# EAGLE design SigueLinea-final-SIN-PLANO-GND (EAGLE 7.4.0)
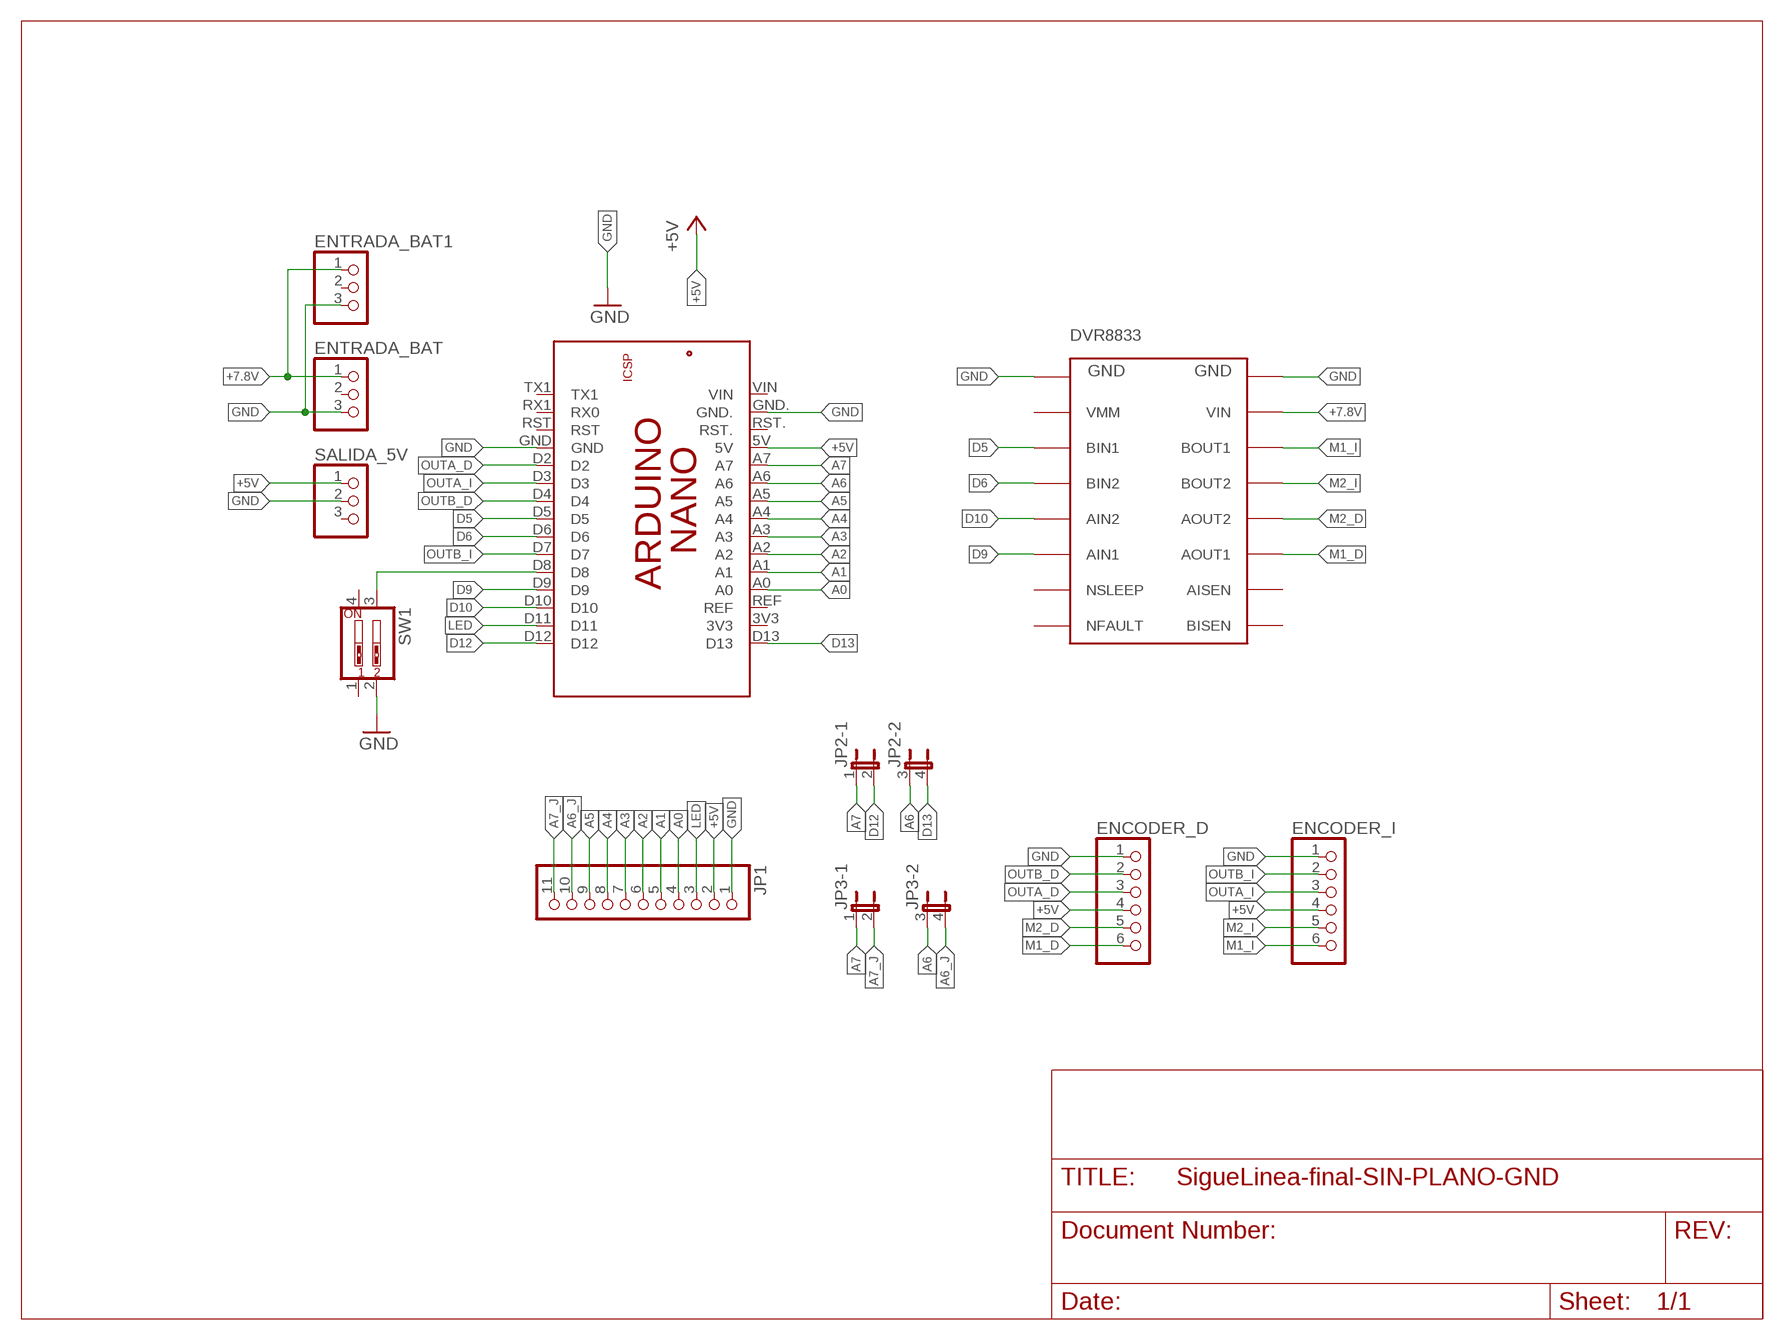
[diagram p0: schematic, sheet 1]

## Parts
DVR8833  DRV8833  [DRV8833]
ENCODER_D  PINHD-1X6  [1X06]
ENCODER_I  PINHD-1X6  [1X06]
ENTRADA_BAT  PINHD-1X3  [1X03]
ENTRADA_BAT1  PINHD-1X3  [1X03]
JP1  PINHD-1X11  [1X11]
JP2  JP2QE  [JP2Q]
JP3  JP2QE  [JP2Q]
PCB1  ARDUINO_NANO  [ARDUINO_NANO]
SALIDA_5V  PINHD-1X3  [1X03]
SW1  SW_DIP-2  [EDG-02]

## Nets
+5V: ENCODER_D.4 ENCODER_I.4 JP1.2 PCB1.5V SALIDA_5V.1
+7.8V: DVR8833.VIN ENTRADA_BAT1.1 ENTRADA_BAT.1
A0: JP1.4 PCB1.A0
A1: JP1.5 PCB1.A1
A2: JP1.6 PCB1.A2
A3: JP1.7 PCB1.A3
A4: JP1.8 PCB1.A4
A5: JP1.9 PCB1.A5
A6: JP2.3 JP3.3 PCB1.A6
A6_J: JP1.10 JP3.4
A7: JP2.1 JP3.1 PCB1.A7
A7_J: JP1.11 JP3.2
D5: DVR8833.BIN1 PCB1.D5
D6: DVR8833.BIN2 PCB1.D6
D9: DVR8833.AIN1 PCB1.D9
D10: DVR8833.AIN2 PCB1.D10
D12: JP2.2 PCB1.D12
D13: JP2.4 PCB1.D13
GND: DVR8833.GND1 DVR8833.GND2 ENCODER_D.1 ENCODER_I.1 ENTRADA_BAT1.3 ENTRADA_BAT.3 JP1.1 PCB1.GND PCB1.GND. SALIDA_5V.2 SW1.2
LED: JP1.3 PCB1.D11
M1_D: DVR8833.AOUT1 ENCODER_D.6
M1_I: DVR8833.BOUT1 ENCODER_I.6
M2_D: DVR8833.AOUT2 ENCODER_D.5
M2_I: DVR8833.BOUT2 ENCODER_I.5
N$1: PCB1.D8 SW1.3
OUTA_D: ENCODER_D.3 PCB1.D2
OUTA_I: ENCODER_I.3 PCB1.D3
OUTB_D: ENCODER_D.2 PCB1.D4
OUTB_I: ENCODER_I.2 PCB1.D7
Unconnected: DVR8833.AISEN DVR8833.BISEN DVR8833.NFAULT DVR8833.NSLEEP DVR8833.VMM ENTRADA_BAT1.2 ENTRADA_BAT.2 PCB1.3V3 PCB1.REF PCB1.RST PCB1.RST. PCB1.RX1(RX0) PCB1.TX1 PCB1.VIN SALIDA_5V.3 SW1.1 SW1.4

## Library data of the parts
DVR8833 = Motor-Driver:DRV8833
ENCODER_D ENCODER_I = pinhead:PINHD-1X6: PIN HEADER
ENTRADA_BAT ENTRADA_BAT1 SALIDA_5V = pinhead:PINHD-1X3: PIN HEADER
JP1 = pinhead:PINHD-1X11: PIN HEADER
JP2 JP3 = jumper:JP2QE: JUMPER
PCB1 = E14_Arduino_revB_modificado:ARDUINO_NANO: Device for representing an Arduino Nano board with a footprint in an EAGLE design. Created by Dave Young for Element14. More EAGLE documentation at: http://www.element14.com/community/community/knode/cadsoft_eagle
SW1 = special:SW_DIP-2: DIP SWITCH

## Board
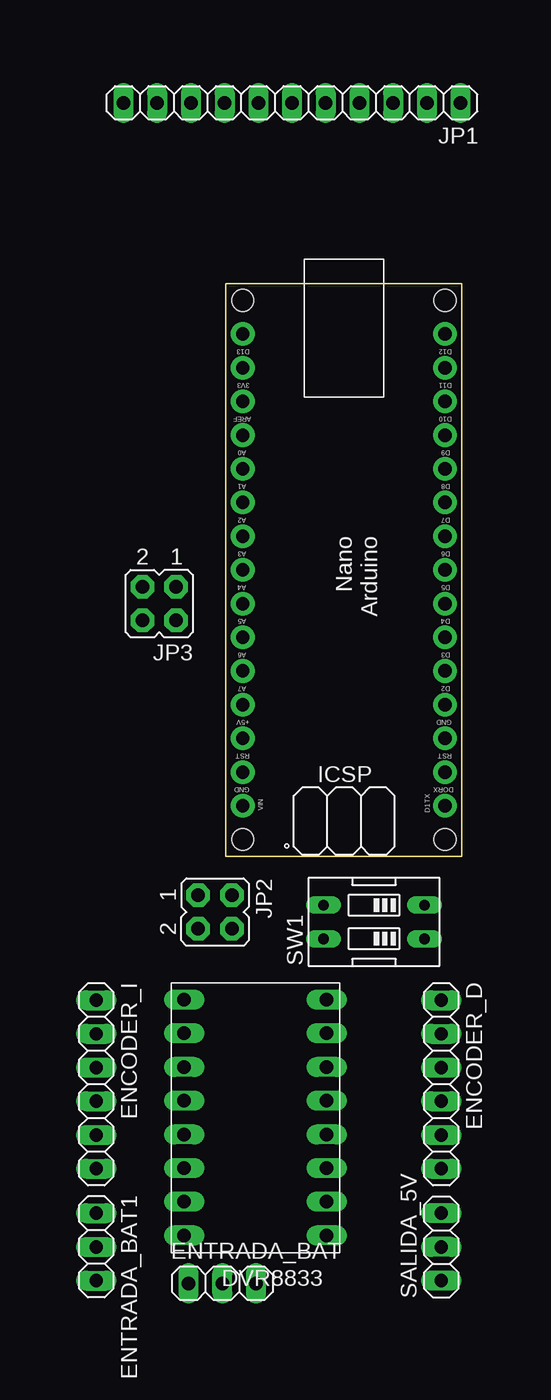
[diagram p1: board, top side]
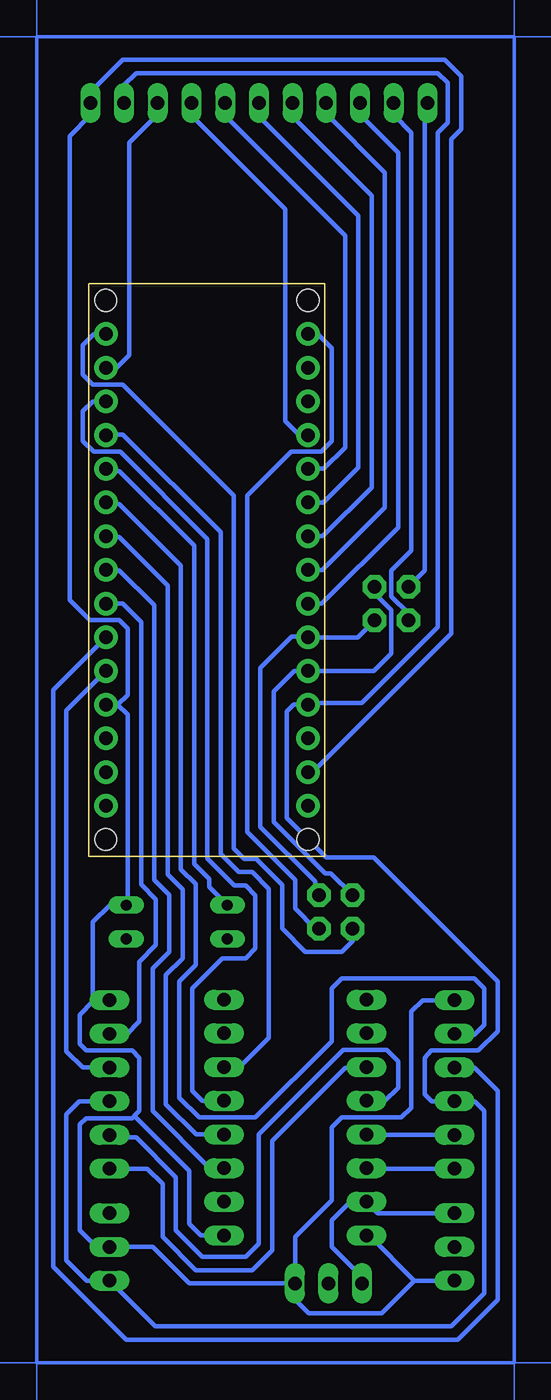
[diagram p2: board, bottom side, seen from below]

Size 17.78 x 43.18 mm. Coordinates in mm from the lower left corner, seen from the top.
Copper layers (1*16): Top 0.035mm / dielectric 1.5mm / Bottom 0.035mm
Design rules "default": minimum track width 10mil, minimum drill 24mil, track to track 8mil, track to pad 8mil, pad to pad 8mil, via to via 8mil, smd to smd 8mil, copper to edge 40mil, drill to drill 8mil, minimum pad ring 10mil, minimum via ring 8mil, stop-mask expansion 4mil, vias tented up to drill 0mil, thermal gap 10mil

### Footprints (pad centres in the part's own frame; a part is rotated, then mirrored left to right if it is on the bottom)
DRV8833 = drill 1.016 long: AIN1 -5.37,-3.83; AIN2 -5.37,-1.29; AISEN 5.37,-6.37; AOUT1 5.37,-3.83; AOUT2 5.37,-1.29; BIN1 -5.37,3.79; BIN2 -5.37,1.25; BISEN 5.37,-8.91; BOUT1 5.37,3.79; BOUT2 5.37,1.25; GND1 -5.37,8.87; GND2 5.37,8.87; NFAULT -5.37,-8.91; NSLEEP -5.37,-6.37; VIN 5.37,6.33; VMM -5.37,6.33
1X06 = drill 1.016 long: 1 -6.35,0; 2 -3.81,0; 3 -1.27,0; 4 1.27,0; 5 3.81,0; 6 6.35,0
1X03 = drill 1.016 long: 1 -2.54,0; 2 0,0; 3 2.54,0
1X11 = drill 1.016 long: 1 -12.7,0; 2 -10.16,0; 3 -7.62,0; 4 -5.08,0; 5 -2.54,0; 6 0,0; 7 2.54,0; 8 5.08,0; 9 7.62,0; 10 10.16,0; 11 12.7,0
JP2Q = drill 1.016 pad 1.778 octagon: 1 -1.27,-1.27; 2 1.27,-1.27; 3 -1.27,1.27; 4 1.27,1.27
ARDUINO_NANO = drill 1.016 pad 1.778: 3V3 6.35,1.27; 5V 31.75,1.27; A0 11.43,1.27; A1 13.97,1.27; A2 16.51,1.27; A3 19.05,1.27; A4 21.59,1.27; A5 24.13,1.27; A6 26.67,1.27; A7 29.21,1.27; D2 29.21,16.51; D3 26.67,16.51; D4 24.13,16.51; D5 21.59,16.51; D6 19.05,16.51; D7 16.51,16.51; D8 13.97,16.51; D9 11.43,16.51; D10 8.89,16.51; D11 6.35,16.51; D12 3.81,16.51; D13 3.81,1.27; GND 31.75,16.51; GND. 36.83,1.27; REF 8.89,1.27; RST 34.29,16.51; RST. 34.29,1.27; RX1 36.83,16.51; TX1 39.37,16.51; VIN 39.37,1.27 | hole 1.651: 1.27,1.27; 1.27,16.51; 41.91,16.51; 41.91,1.27
EDG-02 = drill 0.813 long: 1 -1.27,-3.81; 2 1.27,-3.81; 3 1.27,3.81; 4 -1.27,3.81

### Placement (x,y rotation side)
DVR8833  2.23,-19.72 180 top  (outside the outline)
ENCODER_D  16.23,-17.2 270 top  (outside the outline)
ENCODER_I  -9.77,-17.2 270 top  (outside the outline)
ENTRADA_BAT  -0.27,-32.2 0 top  (outside the outline)
ENTRADA_BAT1  -9.77,-29.45 270 top  (outside the outline)
JP1  4.98,56.8 180 top  (outside the outline)
JP2  -0.82,-4.2 270 top
JP3  -5.02,19.05 180 top  (outside the outline)
PCB1  0,43.18 270 top
SALIDA_5V  16.23,-29.45 90 top  (outside the outline)
SW1  11.16,-4.95 90 top  (outside the outline)

### Tracks (layer width: path | path; a pad name or v marks a point on that pad's centre or on a via)
+5V
  Bottom 0.35: JP1.2 15.14,58.14 14.23,59.05 -8.52,59.05 -9.27,58.3 -9.27,55.3 -8.52,54.55 -8.52,17.3 -2.77,11.55 1.15,11.55 PCB1.5V 2.35,11.43 2.86,10.93 2.86,2.88 -0.12,-0.1 -3.67,-0.1 -13.02,-9.45 -13.02,-13.2 -11.57,-14.65 -8.02,-14.65 -7.52,-15.2 -7.52,-17.95 -8.04,-18.47 ENCODER_I.4 -11.29,-18.47 -12.02,-19.2 -12.02,-32.95 -9.52,-35.45 12.77,-35.45 SALIDA_5V.1 17.94,-31.99 19.48,-30.45 19.48,-19.45 18.5,-18.47 ENCODER_D.4
+7.8V
  Bottom 0.35: ENTRADA_BAT.1 -2.81,-31.74 -0.52,-29.45 -0.52,-27.45 -1.77,-26.2 -2.99,-26.2 DVR8833.VIN -4,-26.91 ENTRADA_BAT1.1
A0
  Bottom 0.35: PCB1.A0 1.93,31.75 2.98,32.8 2.98,48.8 10.06,55.88 JP1.4
A1
  Bottom 0.35: PCB1.A1 0.07,29.21 -1.52,30.8 -1.52,46.8 7.52,55.84 JP1.5
A2
  Bottom 0.35: PCB1.A2 0.11,26.67 -2.52,29.3 -2.52,48.3 4.98,55.8 JP1.6
A3
  Bottom 0.35: PCB1.A3 0.15,24.13 -3.52,27.8 -3.52,49.8 2.44,55.76 JP1.7 | 2.44,57.26 JP1.7 | 2.48,56.8 JP1.7
A4
  Bottom 0.35: PCB1.A4 0.19,21.59 -4.52,26.3 -4.52,51.55 -0.1,55.97 JP1.8
A5
  Bottom 0.35: PCB1.A5 0.23,19.05 -5.52,24.8 -5.52,53.05 -2.64,55.93 JP1.9
A6
  Bottom 0.35: JP3.3 -2.48,16.51 PCB1.A6 1.31,16.55 2.48,16.55 4.86,14.18 4.86,2.23 0.73,-1.9 0.73,-2.65 JP2.3
A6_J
  Bottom 0.35: JP3.4 -6.27,17.8 -6.27,18.35 -5.02,19.6 -5.02,21.55 -6.52,23.05 -6.52,54.55 -5.18,55.89 JP1.10
A7
  Bottom 0.35: JP3.1 -3.77,20.3 -3.77,19.8 -5.02,18.55 -5.02,15.3 -3.69,13.97 PCB1.A7 2.31,13.97 3.86,12.43 3.86,2.58 -0.02,-1.3 -0.46,-1.3 JP2.1
A7_J
  Bottom 0.35: JP3.2 -7.52,21.55 -7.52,56.6 JP1.11
D5
  Bottom 0.35: DVR8833.BIN1 8.67,-23.51 12.98,-19.2 12.98,-8.45 11.73,-7.2 11.73,-2.9 12.86,-1.77 12.86,18.93 15.48,21.55 16.47,21.55 PCB1.D5
D6
  Bottom 0.35: PCB1.D6 16.43,24.05 15.48,24.05 11.86,20.43 11.86,-1.38 10.73,-2.5 10.73,-7.7 11.98,-8.95 11.98,-18.7 9.71,-20.97 DVR8833.BIN2
D9
  Bottom 0.35: PCB1.D9 16.46,31.8 15.23,31.8 7.86,24.43 7.86,0.18 6.48,-1.2 5.48,-1.2 4.23,-2.45 4.23,-13.7 6.48,-15.95 7.54,-15.95 DVR8833.AIN1
D10
  Bottom 0.35: PCB1.D10 17.49,34.29 18.23,33.55 18.23,31.3 17.43,30.5 15.43,30.5 8.86,23.93 8.86,-0.17 6.83,-2.2 5.98,-2.2 5.23,-2.95 5.23,-6.95 5.98,-7.7 7.73,-7.7 9.98,-9.95 9.98,-17.7 9.25,-18.43 DVR8833.AIN2
D12
  Bottom 0.35: PCB1.D12 17.41,39.37 18.23,38.55 18.23,36.3 17.48,35.55 15.23,35.55 6.86,27.18 6.86,0.58 6.08,-0.2 5.18,-0.2 3.23,-2.15 3.23,-5.45 1.48,-7.2 -1.27,-7.2 -2.09,-6.38 JP2.2
D13
  Bottom 0.35: PCB1.D13 0.55,39.37 -0.52,38.3 -0.52,31.3 0.28,30.5 2.53,30.5 5.86,27.18 5.86,1.83 2.23,-1.8 2.23,-3.95 0.71,-5.47 JP2.4
GND
  Bottom 0.35: PCB1.GND 15.6,11.43 | 15.6,11.43 14.86,12.18 14.86,17.18 15.48,17.8 17.73,17.8 19.23,19.3 19.23,54.3 17.68,55.85 JP1.1 17.68,57.6 15.23,60.05 -9.02,60.05 -10.27,58.8 -10.27,54.8 -9.52,54.05 -9.52,16.8 0.93,6.35 PCB1.GND. 1.18,6.35 | 15.6,11.43 15.6,11.42 14.86,10.68 14.86,-3.56 SW1.2 14.99,-3.7 16.23,-3.7 17.48,-4.95 17.48,-10.95 | ENCODER_D.1 17.38,-10.85 17.48,-10.95 | 14.36,-19.57 14.53,-19.75 17.98,-19.75 18.48,-20.2 18.48,-28.2 17.23,-29.45 SALIDA_5V.2 12.98,-29.45 10.23,-32.2 ENTRADA_BAT.3 | 14.36,-19.57 13.98,-19.2 13.98,-15.2 14.53,-14.65 17.98,-14.65 18.48,-14.15 18.48,-11.95 17.48,-10.95 | DVR8833.GND1 9.34,-28.59 10.23,-27.7 10.23,-23.7 14.36,-19.57 | ENCODER_I.1 -7.37,-10.85 -6.52,-11.7 -6.52,-18.95 -5.77,-19.7 -1.27,-19.7 -0.52,-20.45 -0.52,-25.95 2.23,-28.7 2.23,-32.16 ENTRADA_BAT.3 | ENTRADA_BAT1.3 -6.73,-31.99 | -6.73,-31.99 -4.27,-34.45 1.23,-34.45 2.23,-33.45 2.23,-32.24 ENTRADA_BAT.3 | DVR8833.GND2 -3.33,-28.59 -6.73,-31.99
LED
  Bottom 0.35: PCB1.D11 15.7,36.83 14.73,37.8 14.73,53.8 12.6,55.93 JP1.3
M1_D
  Bottom 0.35: ENCODER_D.6 13.38,-23.55 12.23,-24.7 12.23,-28.7 9.73,-31.2 5.48,-31.2 3.98,-29.7 3.98,-21.45 -1.52,-15.95 -3.08,-15.95 DVR8833.AOUT1
M1_I
  Bottom 0.35: ENCODER_I.6 -3.18,-23.55 DVR8833.BOUT1
M2_D
  Bottom 0.35: ENCODER_D.5 16.04,-21.2 14.23,-21.2 11.23,-24.2 11.23,-28.2 9.23,-30.2 5.98,-30.2 4.98,-29.2 4.98,-20.95 -1.37,-14.6 -4.67,-14.6 -5.52,-15.45 -5.52,-17.45 -4.52,-18.45 -3.16,-18.45 DVR8833.AOUT2
M2_I
  Bottom 0.35: ENCODER_I.5 -3.18,-21.01 DVR8833.BOUT2
N$1
  Bottom 0.35: PCB1.D8 16.35,29.05 15.48,29.05 9.86,23.43 9.86,-0.57 8.73,-1.7 8.73,-2.3 SW1.3
N$2
  Bottom 0.254: -14.27,61.8 21.73,61.8 21.73,-38.2 -14.27,-38.2 -14.27,61.8
OUTA_D
  Bottom 0.35: ENCODER_D.3 18.25,-15.93 19.48,-14.7 19.48,11 PCB1.D2
OUTA_I
  Bottom 0.35: PCB1.D3 20.48,12.54 20.48,-30.95 14.98,-36.45 -10.02,-36.45 -13.02,-33.45 -13.02,-17.7 -11.25,-15.93 ENCODER_I.3
OUTB_D
  Bottom 0.35: PCB1.D4 15.23,19.05 13.86,17.68 13.86,-2.12 12.73,-3.25 12.73,-6.7 13.98,-7.95 13.98,-12.45 14.98,-13.45 16.17,-13.45 ENCODER_D.2
OUTB_I
  Bottom 0.35: PCB1.D7 16.39,26.55 15.48,26.55 10.86,21.93 10.86,-0.97 9.73,-2.1 9.73,-8.2 10.98,-9.45 10.98,-18.2 9.48,-19.7 5.23,-19.7 -0.52,-13.95 -0.52,-9.95 -1.27,-9.2 -11.27,-9.2 -12.02,-9.95 -12.02,-12.7 -11.27,-13.45 -9.83,-13.45 ENCODER_I.2
(copper drawn outside any net)
  shapes: Bottom area x4